# Altium schematic sheet Transmitters.SchDoc
size A4; SheetNumber: 5; SheetTotal: 7
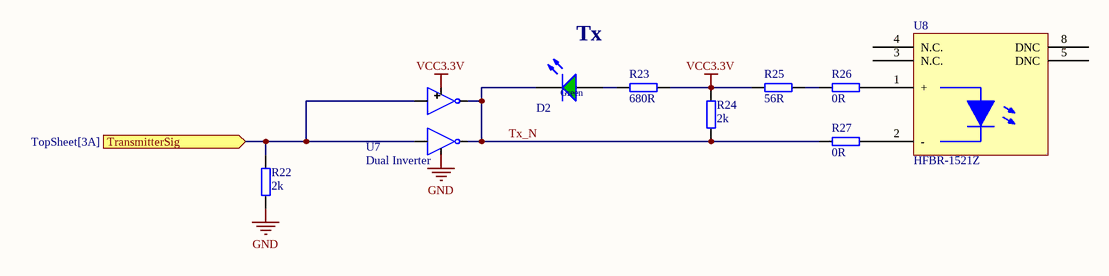
[diagram p0: Transmitters.SchDoc]

## Parts
D2  150060GS75000  [WL-SMCW_0603]  (value not drawn)
R22  2k  [R_0603_N]
R23  680R  [R_0603_N]
R24  2k  [R_0603_N]
R25  56R  [RES_2012X06N]
R26  0R  [R_0603_N]
R27  0R  [R_0603_N]
U7  Dual Inverter  [SN74LVC2GU04DCKR]
U8  HFBR-1521Z  [HFBRx5XX]

## Ports
TransmitterSig (in, see TopSheet[3A])

## Nets
GND: R22.1 U7.2(GND)
VCC3.3V: R23.1 R24.2 R25.1 U7.5(VCC)
TransmitterSig: R22.2 U7.1(IN1) U7.3(IN2) ; port TransmitterSig
Tx_N: D2.1(K) R24.1 R27.1 U7.4(OUT2) U7.6(OUT2)
NetD2_2: D2.2(A) R23.2
NetR25_2: R25.2 R26.1
NetR26_2: R26.2 U8.1(+)
NetR27_2: R27.2 U8.2(-)

Not connected (* = marked no-connect by the designer): U8 3(N.C.) 4(N.C.) 5(DNC) 8(DNC)

## Notes on the sheet
- Tx

## Library data of the parts
D2 = LED_Green_0603: WL-SMCW SMD Mono-color Chip LED Waterclear, size 0603, Green, 3.2 V, 140°; Forward Voltage: 3.2 V; Luminous Intensity: 430 mcd; Peak Wavelength: 515 nm; Dominant Wavelength: 520 nm; MF: Wuerth Elektronik; Published Date: Sep. 2017; ComponentLink1Description: Manufacturer; ComponentLink1URL: http://www.we-online.de; ComponentLink2Description: Datasheet; ComponentLink2URL: http://katalog.we-online.com/led/datasheet/150060GS75000.pdf; MPN: 150060GS75000; Size: 0603; Viewing Angle: 140°; Emitting Color: Green; Value: 150060GS75000; Package: 0603; Created: 2018_09_06_AGeiger; Supplier 1: Farnell; Supplier Part Number 1: 2322070; Supplier 2: Mouser; Supplier Part Number 2: 710-150060GS75000; Supplier 3: Digi-Key; Supplier Part Number 3: 732-4971-1-ND; LCSC Part #: C72043
R22 R24 = R_0603: SMD Resistor 0603; MPN: RC0603FR-072KL; Tolerance: 1%; Voltage: 75 V; Power: 100 mW; MF: Yageo; Package: 0603; Value: 2k; Created: 2018_09_06_AGeiger; Supplier 1: Mouser; Supplier Part Number 1: 603-RC0603FR-072KL; LCSC Part #: C22975
R23 = R_0603: SMD Resistor 0603; MPN: CR0603-FX-3901ELF; Tolerance: 1%; Voltage: 75V; Power: 100 mW; MF: Bourns; Package: 0603; Value: 680R; Created: 2018_09_06_AGeiger; Supplier 1: Mouser; Supplier Part Number 1: 652-CR0603-FX3901ELF; LCSC Part #: C23228
R25 = R_0805: SMD Resistor 0805; MPN: CR0805-FX-1200ELF; Case_EIA: 0805; MF: Bourns; Voltage: 150 V; Power: 125 mW; Tolerance: 1%; Value: 56R; Supplier 1: Mouser; Supplier Part Number 1: 652-CR0805FX-1200ELF*; LCSC Part #: C17437
R26 R27 = R_0603_JLC: SMD Resistor 0603; Tolerance: 1%; Voltage: 75V; Power: 100 mW; Package: 0603; Value: 0R; Created: 2018_09_06_AGeiger; Supplier 1: Mouser; Supplier Part Number 1: 71-CRCW06030000Z0EBC; LCSC Part #: C21189
U7 = SN74LVC2GU04DCKR: This dual inverter is designed for 1.65-V to 5.5-V VCC / operation.; LCSC Part #: C116660; JLCSMT Rotation: 180
U8 = CMP-017-000002-1: Fibre Optic Transmitters, Link Horiz 5MBd Tx RoHS; MF: Broadcom/Avago; Supply Voltage: 5V; Wavelength: 660 nm; Foreward Current: 60 mA; Created: 2019_04_09_Kreppel; Data Rate: 5 MBd; Design Item ID: HFBR-1521Z; MPN: HFBR-1521Z; Source: UZOhm_Optical.SchLib